# Altium schematic sheet TDS.SchDoc
size A; SheetNumber: 4; SheetTotal: 5; SPICEModelCacheXQVYIPPJ: <root> / <DocumentId>XQVYIPPJ</DocumentId> / <CacheFrame Number="0"> / <Model Name="umk107bj105_a-t" Kind="CKT"> / <Text>* UMK107BJ105_A-T     SPICE MODEL  ( General Type ) / *-------------------------------------------------------------------------------------------------------- / * Model Generated by TAIYO YUDEN Corporation (http://www.ty-top.com) / * Version 1.0 / * TAIYO YUDEN Control No. 170508_130520 / * Copyright(c) 2012 TAIYO YUDEN CO.,LTD. All Rights Reserved. / *-------------------------------------------------------------------------------------------------------- / * / * Products Name : Multilayer Ceramic Capacitors / * / * Characteristics : / *     Capacitance : 1 uF , Rated Voltage : 50V , TCC : X5R / *     Case Size : 1.6 x 0.8 / 0.063 x 0.031 [mm/inch] , Thickness : 0.8 / 0.031 [mm/inch] / *     (Conditions: Temperature = 25 degC , DC Bias Current/Voltage = 0A / 0V) / * / * Frequency Range : 40Hz - 3GHz / * / * External Node Assignments : / * / *  1  o---| |---o  2 / * / *-------------------------------------------------------------------------------------------------------- / .SubCkt UMK107BJ105_A-T 1 2 / **************************** / C0 1 110 0.79929u / Cm 1 101 0.13681u / C1 101 102 0.26224u / Rc1 101 102 5.8806k / C2 102 103 0.057839u / Rc2 102 103 469.42 / C3 103 110 0.014568u / Rc3 103 110 14.853 / C2m 1 301 0.13283u / C21 301 302 1.2593u / Rc21 301 302 6.3079k / C22 302 303 1.1189u / Rc22 302 303 6.9405k / C23 303 304 1.1421u / Rc23 303 304 6.4848k / C24 304 305 0.36861u / Rc24 304 305 785 / C25 305 306 0.39327u / Rc25 305 306 637.41 / C26 306 307 0.27451u / Rc26 306 307 19.365 / C27 307 308 0.15295u / Rc27 307 308 23.239 / C28 308 309 0.17569u / Rc28 308 309 17.788 / C29 309 110 1420.6p / Rc29 309 110 1.9725 / Rp0 1 110 500Meg / L0 110 120 0.24088n / Lm 120 130 0.1369n / L1 120 121 0.1842n / RL1 121 130 0.29804 / L2 120 122 0.40657n / RL2 122 130 0.57395 / L3 120 123 0.85773n / RL3 123 130 0.82282 / CR 120 124 0.11463u / LR 124 125 0.25983n / RR 125 130 52.447m / CL 130 140 1.4637p / LL 130 140 0.23986n / RL 130 140 33.985 / Rs 140 2 6.8539m / **************************** / .ends UMK107BJ105_A-T</Text> / </Model> / </CacheFrame> / </root>
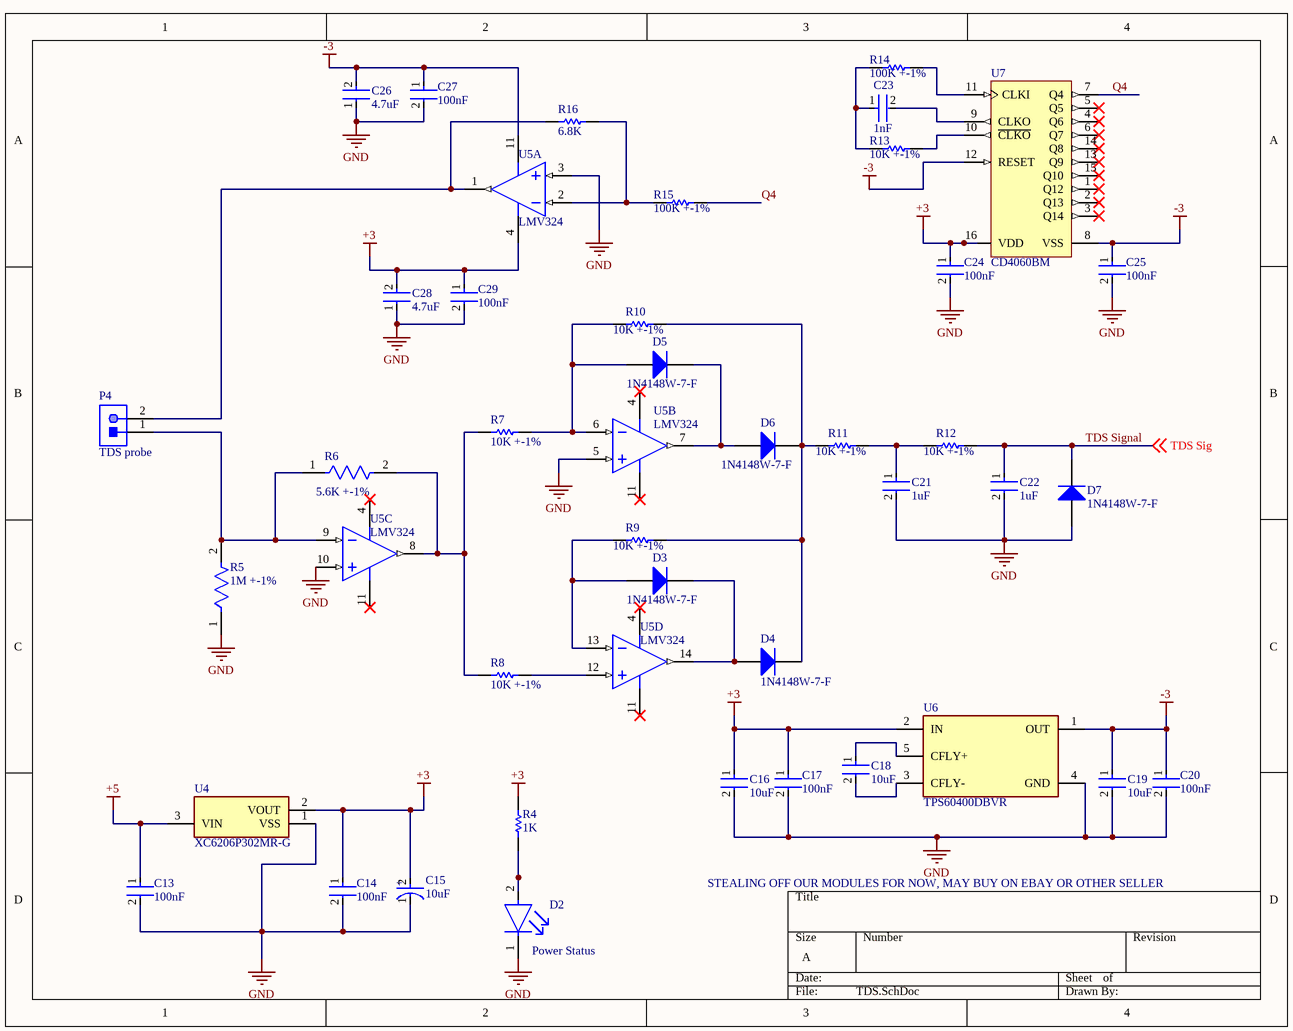
[diagram p0: TDS.SchDoc]

## Parts
C13  100nF  [FP-CGA3E-0_3-0_1-IPC_A]
C14  100nF  [FP-CGA3E-0_3-0_1-IPC_A]
C15  10uF  [FP-T491C106K016AT-MFG]
C16  10uF  [FP-C0805C-DG-MFG]
C17  100nF  [FP-CGA3E-0_3-0_1-IPC_A]
C18  10uF  [FP-C0805C-DG-MFG]
C19  10uF  [FP-C0805C-DG-MFG]
C20  100nF  [FP-CGA3E-0_3-0_1-IPC_A]
C21  1uF  [FP-0603-L_1_6_0_1-W_0_8_0-IPC_A]
C22  1uF  [FP-0603-L_1_6_0_1-W_0_8_0-IPC_A]
C23  1nF  [FP-0603-L_1_6_0_15-W_0_81-IPC_A]
C24  100nF  [FP-CGA3E-0_3-0_1-IPC_A]
C25  100nF  [FP-CGA3E-0_3-0_1-IPC_A]
C26  4.7uF  [FP-GRM188-0_1-MFG]
C27  100nF  [FP-CGA3E-0_3-0_1-IPC_A]
C28  4.7uF  [FP-GRM188-0_1-MFG]
C29  100nF  [FP-CGA3E-0_3-0_1-IPC_A]
D2  Power Status  [FP-LTST-C191TBKT-MFG]
D3  1N4148W-7-F  [DIOD-SOD123-2_V]
D4  1N4148W-7-F  [DIOD-SOD123-2_V]
D5  1N4148W-7-F  [DIOD-SOD123-2_V]
D6  1N4148W-7-F  [DIOD-SOD123-2_V]
D7  1N4148W-7-F  [DIOD-SOD123-2_V]
P4  TDS probe  [JST-S2B-PH-K-S_V]
R4  1K  [RESC2013X50X30NL20T20]
R5  1M +-1%  [FP-CRCW0603-e3-MFG]
R6  5.6K +-1%  [FP-CRCW0603-e3-MFG]
R7  10K +-1%  [RESC1609X50X30NL8T20]
R8  10K +-1%  [RESC1609X50X30NL8T20]
R9  10K +-1%  [RESC1609X50X30NL8T20]
R10  10K +-1%  [RESC1609X50X30NL8T20]
R11  10K +-1%  [RESC1609X50X30NL8T20]
R12  10K +-1%  [RESC1609X50X30NL8T20]
R13  10K +-1%  [RESC1609X50X30NL8T20]
R14  100K +-1%  [RESC1608X55X30ML20T20]
R15  100K +-1%  [RESC1608X55X30ML20T20]
R16  6.8K  [RESC1609X50X30LL10T20]
U4  XC6206P302MR-G  [SOT95P280X130-3N]
U5  LMV324  [D0014A_V]  (parts A,B,C,D of 4)
U6  TPS60400DBVR  [FP-DBV0005A-IPC_B]
U7  CD4060BM  [D0016A_M]

## Nets
+3: C14.1 C15.2(A) C16.1 C17.1 C24.1 C28.2 C29.1 R4.2 U4.2(VOUT) U5.4(VCC+) U6.2(IN) U7.16(VDD)
+5: C13.1 U4.3(VIN)
-3: C19.1 C20.1 C25.1 C26.2 C27.1 U5.11(GND) U6.1(OUT) U7.8(VSS) U7.12(RESET)
GND: C13.2 C14.2 C15.1(C) C16.2 C17.2 C19.2 C20.2 C21.2 C22.2 C24.2 C25.2 C26.1 C27.2 C28.1 C29.2 D2.1(C) D7.1(A) R5.1 U4.1(VSS) U5.3(1IN+) U5.5(2IN+) U5.10(3IN+) U6.4(GND)
Q4: R15.2 U7.7(Q4)
TDS Signal: C22.1 D7.2(K) R12.2 ; off-sheet TDS Sig  [also labelled TDS Sig]
NetC18_1: C18.1 U6.5(CFLY+)
NetC18_2: C18.2 U6.3(CFLY-)
NetC21_1: C21.1 R11.2 R12.1
NetC23_1: C23.1 R13.1 R14.1
NetC23_2: C23.2 U7.9(CLKO)
NetD2_2: D2.2(A) R4.1
NetD3_1: D3.1(A) R9.1 U5.13(4IN-)
NetD3_2: D3.2(K) D4.1(A) U5.14(4OUT)
NetD4_2: D4.2(K) D6.2(K) R9.2 R10.2 R11.1
NetD5_1: D5.1(A) R7.2 R10.1 U5.6(2IN-)
NetD5_2: D5.2(K) D6.1(A) U5.7(2OUT)
NetP4_1: P4.1 R5.2 R6.1 U5.9(3IN-)
NetP4_2: P4.2 R16.1 U5.1(1OUT)
NetR6_2: R6.2 R7.1 R8.1 U5.8(3OUT)
NetR8_2: R8.2 U5.12(4IN+)
NetR13_2: R13.2 U7.10(~{CLKO})
NetR14_2: R14.2 U7.11(CLKI)
NetR15_1: R15.1 R16.2 U5.2(1IN-)

Not connected (* = marked no-connect by the designer): U7 1(Q12)* 2(Q13)* 3(Q14)* 4(Q6)* 5(Q5)* 6(Q7)* 13(Q9)* 14(Q8)* 15(Q10)*

## Notes on the sheet
- STEALING OFF OUR MODULES FOR NOW, MAY BUY ON EBAY OR OTHER SELLER
- (in symbol CMP-2000-07197-3) +

## Library data of the parts
C13 C14 C17 C20 C24 C25 C27 C29 = CMP-2000-07546-2: Cap Ceramic 100nF 50V X7R 10% Pad SMD 0603 +125°C Automotive T/R; Weight: 7.1E-05oz; Composition: Ceramic; Max Operating Temperature: 125°C; Termination: SMD/SMT; Dielectric: X7R; Length: 1.6mm; Package Quantity: 1; REACH SVHC: No SVHC; Lead Free: Lead Free; Case Code (Metric): 1608; Min Operating Temperature: -55°C; Packaging: Tape and Reel; Tolerance: 10%; Voltage Rating: 50V; Case Code (Imperial): 0603; Capacitance: 100nF; Case/Package: 0603; Voltage Rating (DC): 50V; Depth: 0.8mm; Radiation Hardening: No; Ratings: AEC-Q200; Mount: Surface Mount; Voltage: 50V; Thickness: 0.035inch; Width: 0.8mm; Height: 0.8mm
C15 = CMP-2000-07197-3: CAP TANT 10UF 10% 16V 2312; Dielectric Material: Tantalum; Polarity: Polar; Dissipation Factor: 6%; Leakage Current: 1.6uA; Ripple Current: 247mA; Life (Hours): 2000Hour; ESR (Equivalent Series Resistance): 1.8R; Height: 2.5mm; Length: 6mm; Min Operating Temperature: -55°C; Case/Package: Molded; Voltage: 16V; Height - Seated (Max): 0.11inch; Package Quantity: 1; RoHS Compliant: Yes; Termination: SMD/SMT; REACH SVHC: No SVHC; Case Code (Imperial): 2312; Tolerance: 10%; Capacitance: 10uF; Voltage Rating (DC): 16V; Mount: Surface Mount; Radiation Hardening: No; Case Code (Metric): 6032; Packaging: Tape and Reel; Depth: 3.2mm; Width: 3.2mm; Max Operating Temperature: 125°C; Features: General Purpose; Voltage Rating: 16V; Lead Free: Lead Free
C16 C18 C19 = CMP-2007-03243-2: CAP CER 10UF 10V X5R 0805; Manufacturer Part Number: C0805C106K8PACTU; Manufacturer: Kemet; 3DS Part Number: 220-00001; Tolerance: 10%; Temperature Coefficient: 15%; Material: Ceramic; Device Class L2: Capacitors; Device Class L1: Passive Components; ComponentLink2URL: https://content.kemet.com/datasheets/KEM_C1006_X5R_SMD.pdf; Height: 1.4mm; Lead Free: Yes; Digikey Description: CAP CER 10UF 10V X5R 0805; Octopart: https://octopart.com/c0805c106k8pactu-kemet-98697; Capacitance: 10uF; Value: 10uF; Temperature Range Low: -55°C; Temperature: -55°C to +85°C; Automotive: No; Mouser Description: CAP CER 10UF 10V X5R 0805; Ipc Land Pattern Name: CAPC200125X125; Temperature Range High: +85°C; Voltage: 10V; RoHS: TRUE; Device Class L3: Ceramic Capacitors; ComponentLink2Description: Datasheet; Voltage Rating: 10V; Package: C0805C-DG; Temperature Characteristic: X5R; Category: Cap
C21 C22 = CMP-2000-05447-3: None; Tolerance: 10%; Voltage Rating: 50V; Dielectric: X5R; Height: 0.8mm; Depth: 0.8mm; Number of Pins: 2; Length: 1.6mm; Thickness: 0.035inch; Contact Plating: Nickel; Radiation Hardening: No; Package Quantity: 1; Case/Package: 0603; Capacitance: 1uF; Halogen Free: Halogen Free; RoHS Compliant: Yes; Termination: SMD/SMT; Max Operating Temperature: 85°C; Min Operating Temperature: -55°C; Case Code (Metric): 1608; Construction: Flat; Voltage Rating (DC): 50V; Packaging: Tape and Reel; Series: M; Case Code (Imperial): 0603; Width: 0.031inch; Mount: Surface Mount
C23 = CMP-2006-04378-2: General Purpose Ceramic Capacitor, 0603, 1nF, 10%, X7R, 15%, 50V; Case Code (Metric): 1608; Min Operating Temperature: -55°C; Weight: 7.1E-05oz; Series: -; Capacitance: 1nF; RoHS Compliant: Yes; Radiation Hardening: No; Height: 0.9mm; Mount: Surface Mount; REACH SVHC: No SVHC; Lead Free: Lead Free; Depth: 0.81mm; Voltage: 50V; Number of Pins: 2; Voltage Rating: 50V; Max Operating Temperature: 125°C; Termination: SMD/SMT; Construction: Flat; Case Code (Imperial): 0603; Dielectric: X7R; Width: 0.032inch; Tolerance: 10%; Case/Package: 0603; Contact Plating: Tin; Packaging: Tape and Reel; Voltage Rating (DC): 50V; Dielectric Material: Ceramic; Package Quantity: 4000; Thickness: 0.035inch; Length: 1.6mm
C26 C28 = CMP-2006-02799-3: CAP CER 4.7UF 6.3V X5R 0603; Material: Ceramic; Tolerance: 10%; Max Operating Temperature: 85°C; REACH SVHC: No SVHC; Thickness: 0.035inch; Voltage Rating: 6.3V; Package Quantity: 1; Radiation Hardening: No; Capacitance: 4.7uF; Voltage: 6.3V; Case Code (Metric): 1608; Dielectric: X5R; Mount: Surface Mount; RoHS Compliant: Yes; Height: 0.8mm; Voltage Rating (DC): 6.3V; Width: 0.8mm; Lead Free: Lead Free; Case Code (Imperial): 0603; Packaging: Tape and Reel; Length: 1.6mm; Case/Package: 0603; Termination: SMD/SMT; Min Operating Temperature: -55°C; Depth: 0.8mm
D2 = CMP-22017-000008-1: LED BLUE CLEAR CHIP SMD; Lens Color: Colorless; Dominant Wavelength: 475nm; Forward Current: 20mA; Wavelength: 468nm; Viewing Angle: 130°; Power Dissipation: 76mW; Luminous Intensity: 180mcd; Reverse Voltage: 5V; Number of Elements: 1; Lens Style: Diffused; Forward Voltage: 3.8V; Max Power Dissipation: 75mW; Case Code (Metric): 1608; Packaging: Tape and Reel; Case/Package: 0603; Depth: 1.6mm; Mount: Surface Mount; Lead Free: Lead Free; Min Operating Temperature: -20°C; Lens Transparency: Clear; Illumination Color: Blue; Height: 0.55mm; Test Current: 20mA; Case Code (Imperial): 0603; Max Operating Temperature: 80°C; Number of Pins: 2; Length: 0.8mm; Radiation Hardening: No; Package Quantity: 1; Number of LEDs: 1; Width: 0.8mm; Color: Blue
D3-D7 = CMP-2000-04932-2: Fast Switching Diode, 100 V, 0.15 A, -65 to 150 degC, 2-Pin?SOD123, RoHS, Tape and Reel; Recovery Time: 4ns; Brand: DiodesIncorporated; Unit Weight: 0.000353oz; Max Surge Current: 2A; Peak Reverse Voltage: 100V; Ir - Reverse Current: 1uA; Vf - Forward Voltage: 1.25V; Configuration: Single; If - Forward Current: 0.15A; Product Category: Diodes-GeneralPurpose,Power,Switching; Operating Temperature Range: -65Cto+150C; Packaging: Reel; Manufacturer URL: http://www.diodes.com/; Maximum Operating Temperature: +150C; Height: 1.25mm; Minimum Operating Temperature: -65C; Product: SwitchingDiodes; Package URL: http://www.diodes.com/datasheets/ds18004.pdf; Type: SwitchingDiode; Package Reference: SOD123-2; Width: 1.7mm; Datasheet URL: http://www.farnell.com/datasheets/1915529.pdf; Datasheet Version: Rev. 24-2, 10/2013; Series: 1N4148; Factory Pack Quantity: 3000; Length: 2.85mm; RoHS: True; Manufacturer: DiodesIncorporated; Mounting Style: SMD/SMT; Package / Case: SOD-123
P4 = CMP-1755-00004-1: Male Header, Pitch 2 mm, 1 x 2 Position, Height 4.8 mm, Tail Length 3.4 mm, -25 to 85 degC, RoHS, Bulk; Case\Package: Radial; Tolerance: 20%; Capacitance: 10 uF; Voltage Rating (DC): 50 V; Packaging: Bulk; ComponentLink1URL: http://www.jst-mfg.com/product/pdf/eng/ePH.pdf; Radiation Hardening: No; Height: 11 mm; Package Quantity: 200; PackageDescription: Male Header, Pitch 2 mm, 1 x 2 Position, Height 4.8 mm, Tail Length 3.4 mm; PackageReference: S2B-PH-K-S; Diameter: 5 mm; Pins: 2; Mount: Through Hole; Max Operating Temperature: 85 degC; Min Operating Temperature: -40 degC; ComponentLink1Description: Datasheet; DatasheetVersion: Dec-12; Length: 11 mm; Lead Pitch: 2 mm; REACH SVHC: No SVHC; Voltage Rating: 50 V; RoHSCompliant: true
R4 = CMP-1013-00510-2: Part Number: CRCW08051K00FKEA; Manufacturer: Vishay Dale
R5 = CMP-2000-03013-2: RES Thick Film, 1MΩ, 1%, 0.1W, 100ppm/°C, 0603; Max Power Dissipation: 100mW; Resistance: 1MR; Voltage Rating (DC): 75V; Depth: 0.85mm; Max Operating Temperature: 155°C; Length: 1.55mm; Power Rating: 100mW; Military Standard: Not; Features: Automotive AEC-Q200; Min Operating Temperature: -55°C; Number of Pins: 2; Mount: Surface Mount; Package Quantity: 10; Packaging: Tape and Reel; Height: 0.45mm; Radiation Hardening: No; Case Code (Metric): 1608; Temperature Coefficient: 100ppm/°C; Width: 0.85mm; Composition: Thick Film; Termination: SMD/SMT; Tolerance: 1%; Number of Terminations: 2; Lead Free: Lead Free; Contact Plating: Tin; Case/Package: 0603; Weight: 7.1E-05oz; Voltage Rating: 75V; Case Code (Imperial): 0603
R6 = CMP-2000-03487-2: RES Thick Film, 5.6kΩ, 1%, 0.1W, 100ppm/°C, 0603; Voltage Rating: 75V; Power Rating: 100mW; Resistance: 5.6kR; Packaging: Tape and Reel; Case/Package: 0603; Depth: 0.85mm; Package Quantity: 5000; Working Voltage: 75V; Case Code (Metric): 1608; Height: 0.45mm; Voltage Rating (DC): 75V; Tolerance: 1%; Number of Pins: 2; Weight: 7.1E-05oz; Composition: Thick Film; Width: 0.85mm; Temperature Coefficient: 100ppm/°C; Min Operating Temperature: -55°C; Radiation Hardening: No; Contact Plating: Tin; Case Code (Imperial): 0603; Max Operating Temperature: 155°C; Mount: Surface Mount; Length: 1.55mm; Lead Free: Lead Free; Military Standard: Not; Number of Terminations: 2; Termination: SMD/SMT
R7-R13 = CMP-1666-00005-4: Chip Resistor, 10 KOhm, +/- 1%, 100 mW, -55 to 155 degC, 0603 (1608 Metric), RoHS, Tape and Reel; Manufacturer: Vishay Semiconductor; Voltage Rating: 75 V; Max Operating Temperature: 155 degC; PackageDescription: 2-Pin Surface Mount Device, Body 1.575 x 0.85 mm; ComponentLink1Description: Manufacturer URL; RoHSCompliant: true; PackageReference: 0603; REACH SVHC: Unknown; Length: 1.55 mm; DatasheetVersion: 06/2012; Packaging: Tape and Reel; Min Operating Temperature: -55 degC; Mounting Technology: Surface Mount; ComponentLink2URL: https://datasheet.ciiva.com/11809/0900766b80d98afc-11809037.pdf; Height: 0.45 mm; ComponentLink2Description: Datasheet; Package Quantity: 5000; ComponentLink1URL: http://www.vishay.com/
R14 R15 = CMP-2000-00875-1: Part Number: ERA3AEB104V; Manufacturer: Panasonic
R16 = CMP-2000-03550-1: Part Number: CRCW06036K80FKEA; Manufacturer: Vishay Dale
U4 = XC6206P302MR-G: Integrated Circuit; Manufacturer_Name: Torex; Datasheet Link: https://www.torexsemi.com/file/xc6206/XC6206.pdf; Height: 1.3mm; Manufacturer_Part_Number: XC6206P302MR-G; Mouser Part Number: 865-XC6206P302MR-G; Mouser Price/Stock: https://www.mouser.co.uk/ProductDetail/Torex-Semiconductor/XC6206P302MR-G?qs=AsjdqWjXhJ%2FCPGHa4B8pZA%3D%3D
U5 = CMP-1685-00010-1: Quad Low-Voltage Rail-to-Rail Output Operational Amplifier, 2.7 to 5.5 V, -40 to 125 degC, 14-Pin SOIC (D), Green (RoHS & no Sb/Br), Tape and Reel; ComponentLink3Description: Package Specification; ComponentLink2URL: http://www.ti.com/lit/ds/symlink/lmv324.pdf; ComponentLink3URL: http://www.ti.com/lit/ml/mpds177g/mpds177g.pdf; DatasheetVersion: SLOS263W, 10/2014; ComponentLink1URL: http://www.ti.com/; Code_JEDEC: MS-012; ComponentLink1Description: Manufacturer URL; PackageDescription: 14-Pin Small Outline Integrated Circuit, Body 8.65 x 3.9 mm, Pitch 1.27 mm; PackageReference: D0014A; ComponentLink2Description: Datasheet
U6 = CMP-0391-00019-3: IC REG CHARG PUMP INV 60MA SOT23; Number of Outputs: 1; Min Supply Voltage: 1.8V; Max Supply Voltage: 5.25V; Max Output Voltage: -5.25V; Operating Supply Current: 125uA; Logic Function: Inverting; Min Output Voltage: -1.6V; Output Type: Adjustable; Switching Frequency: 250kHz; Synchronous Rectifier: No; Min Operating Temperature: -40°C; Number of Pins: 5; Package Quantity: 3000; Min Input Voltage: 1.8V; Max Operating Temperature: 85°C; Packaging: Tape and Reel; Output Current: 60mA; Max Input Voltage: 5.25V; Weight: 0.000459oz; Lead Free: Lead Free; Output Voltage: -5.25V; Contact Plating: Gold; Radiation Hardening: No; Quiescent Current: 125uA; Max Output Current: 60mA; REACH SVHC: No SVHC; Case/Package: SOT-23-5
U7 = CMP-1086-00003-4: CMOS 14-Stage Ripple Carry Binary Counter / Divider and Oscillator, 3 to 18 V, -55 to 125 degC, 16-Pin SOIC (D), Green (RoHS & no Sb/Br), Tube; Manufacturer: Texas Instruments; VDD: 3 to 18 V; tPHL, tPLH (typ) @ 5 V: 370 ns; PartNumber: CD4060BM; ComponentLink3Description: Package Specification; ComponentLink1Description: Manufacturer URL; ComponentLink2URL: http://www.ti.com/lit/ds/symlink/cd4060b.pdf; Mounting Technology: Surface Mount; PackageDescription: 16-Pin Plastic Small-Outline Package, Body 9.9 x 3.9 mm, Pitch 1.27 mm; ComponentLink2Description: Datasheet; ComponentLink1URL: http://www.ti.com; PackageReference: D0016A; Temperature Range: -55 to 125 degC; ComponentLink3URL: http://www.ti.com/lit/ml/mpds178g/mpds178g.pdf; PackageVersion: 4040047-6/M; Note1: Green (RoHS & no Sb/Br); Packing: Tube; DatasheetVersion: SCHS049C